# EAGLE design ife19_TS_BMS_LTC6813_Testing (EAGLE 9.2.2)

## Sheet 1 of 3: Power
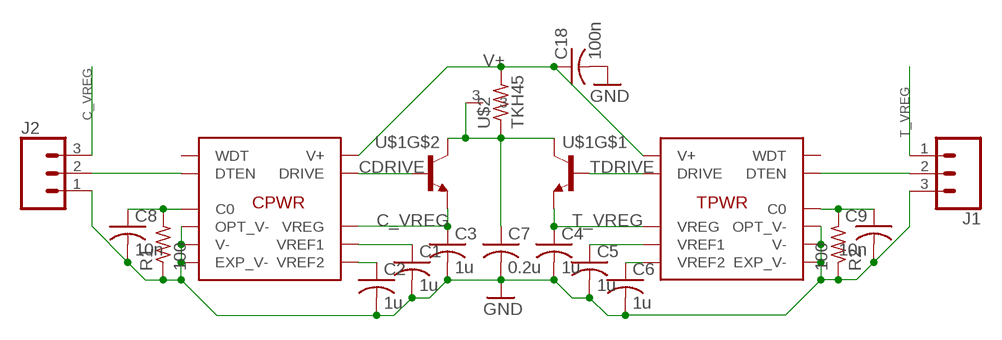
[diagram p0: schematic, sheet 1]

### Parts
C  LTC6813-1  [HTQFP-64-EXP]
C1  1u  C-USC0603  [C0603]
C2  1u  C-USC0603  [C0603]
C3  1u  C-USC0603  [C0603]
C4  1u  C-USC0603  [C0603]
C5  1u  C-USC0603  [C0603]
C6  1u  C-USC0603  [C0603]
C7  0.2u  C-USC1206  [C1206]
C8  10n  C-USC0603  [C0603]
C9  10n  C-USC0603  [C0603]
C18  100n  C-USC0603  [C0603]
J1  CONN_03  [1X03]
J2  CONN_03  [1X03]
R1  100  R-US_R0603  [R0603]
R2  100  R-US_R0603  [R0603]
T  LTC6813-1  [HTQFP-64-EXP]
U$1  PHPT610030NK  [LFPAK56D]
U$2  TKH45  [TO252-TKH-45]

### Nets
C_VREG: C3.1 C.48(PWR:VREG) J2.3 U$1.E2(E) ; also sheet 3
CDRIVE: C.49(PWR:DRIVE) U$1.B2(B)
GND: C1.2 C2.2 C3.2 C4.2 C5.2 C6.2 C7.2 C8.2 C9.2 C18.2 C.59(PWR:V-) C.60(PWR:OPT_V-) C.65(PWR:EXP_V-) J1.3 J2.1 R1.1 R2.1 T.59(PWR:V-) T.60(PWR:OPT_V-) T.65(PWR:EXP_V-) ; also sheet 2,3
N$4: C1.1 C.51(PWR:VREF1)
N$5: C2.1 C.50(PWR:VREF2)
N$7: C5.1 T.51(PWR:VREF1)
N$8: C6.1 T.50(PWR:VREF2)
N$9: C8.1 C.38(PWR:C0) R1.2
N$12: C7.1 U$1.C1(C) U$1.C2(C) U$2.1 U$2.3
N$15: C9.1 R2.2 T.38(PWR:C0)
N$41: J1.2 T.52(PWR:DTEN)
N$62: C.52(PWR:DTEN) J2.2
T_VREG: C4.1 J1.1 T.48(PWR:VREG) U$1.E1(E) ; also sheet 3
TDRIVE: T.49(PWR:DRIVE) U$1.B1(B)
V+: C18.1 C.1(PWR:V+) T.1(PWR:V+) U$2.2
Unconnected: C.56(PWR:WDT) T.56(PWR:WDT)

## Sheet 2 of 3: Cells
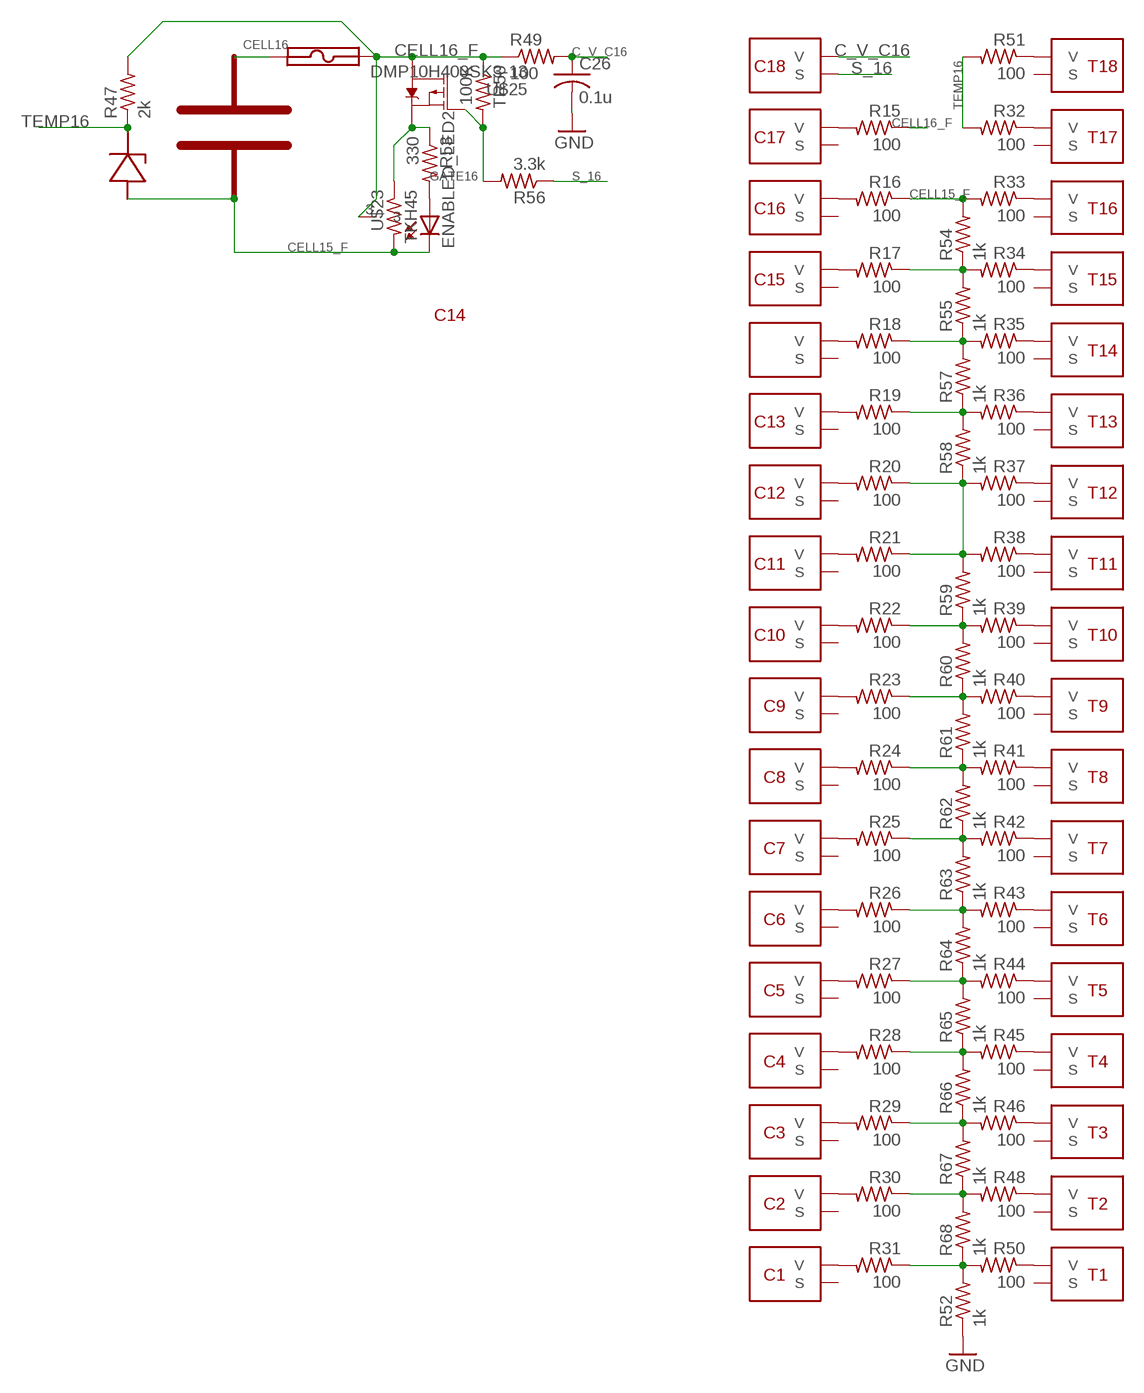
[diagram p1: schematic, sheet 2]

### Parts
C26  0.1u  C-USC0603K  [C0603K]
ENABLED_LED2  LEDCHIPLED_0603  [CHIPLED_0603]
R15  100  R-US_R0603  [R0603]
R16  100  R-US_R0603  [R0603]
R17  100  R-US_R0603  [R0603]
R18  100  R-US_R0603  [R0603]
R19  100  R-US_R0603  [R0603]
R20  100  R-US_R0603  [R0603]
R21  100  R-US_R0603  [R0603]
R22  100  R-US_R0603  [R0603]
R23  100  R-US_R0603  [R0603]
R24  100  R-US_R0603  [R0603]
R25  100  R-US_R0603  [R0603]
R26  100  R-US_R0603  [R0603]
R27  100  R-US_R0603  [R0603]
R28  100  R-US_R0603  [R0603]
R29  100  R-US_R0603  [R0603]
R30  100  R-US_R0603  [R0603]
R31  100  R-US_R0603  [R0603]
R32  100  R-US_R0603  [R0603]
R33  100  R-US_R0603  [R0603]
R34  100  R-US_R0603  [R0603]
R35  100  R-US_R0603  [R0603]
R36  100  R-US_R0603  [R0603]
R37  100  R-US_R0603  [R0603]
R38  100  R-US_R0603  [R0603]
R39  100  R-US_R0603  [R0603]
R40  100  R-US_R0603  [R0603]
R41  100  R-US_R0603  [R0603]
R42  100  R-US_R0603  [R0603]
R43  100  R-US_R0603  [R0603]
R44  100  R-US_R0603  [R0603]
R45  100  R-US_R0603  [R0603]
R46  100  R-US_R0603  [R0603]
R47  2k  R-US_R0603  [R0603]
R48  100  R-US_R0603  [R0603]
R49  100  R-US_R0603  [R0603]
R50  100  R-US_R0603  [R0603]
R51  100  R-US_R0603  [R0603]
R52  1k  R-US_R0603  [R0603]
R53  330  R-US_R0603  [R0603]
R54  1k  R-US_R0603  [R0603]
R55  1k  R-US_R0603  [R0603]
R56  3.3k  R-US_R0603  [R0603]
R57  1k  R-US_R0603  [R0603]
R58  1k  R-US_R0603  [R0603]
R59  1k  R-US_R0603  [R0603]
R60  1k  R-US_R0603  [R0603]
R61  1k  R-US_R0603  [R0603]
R62  1k  R-US_R0603  [R0603]
R63  1k  R-US_R0603  [R0603]
R64  1k  R-US_R0603  [R0603]
R65  1k  R-US_R0603  [R0603]
R66  1k  R-US_R0603  [R0603]
R67  1k  R-US_R0603  [R0603]
R68  1k  R-US_R0603  [R0603]
TR50  100K  R-US_R0603  [R0603]
U$6  LI6PT  [6PT]
U$22  04661206  [R1206W]
U$23  TKH45  [TO252-TKH-45]
U$25  DMP10H400SK3-13  [TO252]

### Nets
C_V_C16: C26.1 C.2(18:V) R49.2
CELL15_F: ENABLED_LED2.C R16.1 R33.2 R54.2 U$6.1(TEMP-) U$6.CELLH-(CELL-) U$6.CELLP-(CELL-) U$23.2
CELL16: U$6.CELLH+(CELL+) U$6.CELLP+(CELL+) U$22.1
CELL16_F: R15.1 R47.2 R49.1 TR50.1 U$22.2 U$23.3 U$25.2(D)
GATE16: R56.2 TR50.2 U$25.1(G)
GND: C26.2 R52.1 ; also sheet 1,3
N$3: ENABLED_LED2.A R53.2
N$6: C.4(17:V) R15.2
N$14: C.6(16:V) R16.2
N$17: C.8(15:V) R17.2
N$27: C.10(14:V) R18.2
N$28: C.12(13:V) R19.2
N$30: C.14(12:V) R20.2
N$31: C.16(11:V) R21.2
N$32: C.18(10:V) R22.2
N$33: C.20(9:V) R23.2
N$34: C.22(8:V) R24.2
N$35: C.24(7:V) R25.2
N$36: C.26(6:V) R26.2
N$37: C.28(5:V) R27.2
N$38: C.30(4:V) R28.2
N$39: C.32(3:V) R29.2
N$40: C.34(2:V) R30.2
N$42: C.36(1:V) R31.2
N$43: R32.1 T.4(17:V)
N$44: R33.1 T.6(16:V)
N$45: R34.1 T.8(15:V)
N$46: R35.1 T.10(14:V)
N$47: R36.1 T.12(13:V)
N$48: R37.1 T.14(12:V)
N$49: R38.1 T.16(11:V)
N$50: R39.1 T.18(10:V)
N$51: R40.1 T.20(9:V)
N$52: R41.1 T.22(8:V)
N$53: R42.1 T.24(7:V)
N$54: R43.1 T.26(6:V)
N$55: R44.1 T.28(5:V)
N$56: R45.1 T.30(4:V)
N$57: R46.1 T.32(3:V)
N$58: R48.1 T.34(2:V)
N$59: R50.1 T.36(1:V)
N$60: R51.1 T.2(18:V)
N$63: R20.1 R21.1 R37.2 R38.2 R58.1 R59.2
N$64: R17.1 R34.2 R54.1 R55.2
N$65: R18.1 R35.2 R55.1 R57.2
N$66: R19.1 R36.2 R57.1 R58.2
N$67: R22.1 R39.2 R59.1 R60.2
N$68: R23.1 R40.2 R60.1 R61.2
N$69: R24.1 R41.2 R61.1 R62.2
N$70: R25.1 R42.2 R62.1 R63.2
N$71: R26.1 R43.2 R63.1 R64.2
N$72: R27.1 R44.2 R64.1 R65.2
N$73: R28.1 R45.2 R65.1 R66.2
N$74: R29.1 R46.2 R66.1 R67.2
N$75: R30.1 R48.2 R67.1 R68.2
N$76: R31.1 R50.2 R52.2 R68.1
N$77: R53.1 U$23.1 U$25.3(S)
S_16: C.3(18:S) R56.1
TEMP16: R32.2 R47.1 R51.2 U$6.2(TEMP+)
Unconnected: C.5(17:S) C.7(16:S) C.9(15:S) C.11(14:S) C.13(13:S) C.15(12:S) C.17(11:S) C.19(10:S) C.21(9:S) C.23(8:S) C.25(7:S) C.27(6:S) C.29(5:S) C.31(4:S) C.33(3:S) C.35(2:S) C.37(1:S) T.3(18:S) T.5(17:S) T.7(16:S) T.9(15:S) T.11(14:S) T.13(13:S) T.15(12:S) T.17(11:S) T.19(10:S) T.21(9:S) T.23(8:S) T.25(7:S) T.27(6:S) T.29(5:S) T.31(4:S) T.33(3:S) T.35(2:S) T.37(1:S)

## Sheet 3 of 3: Comms
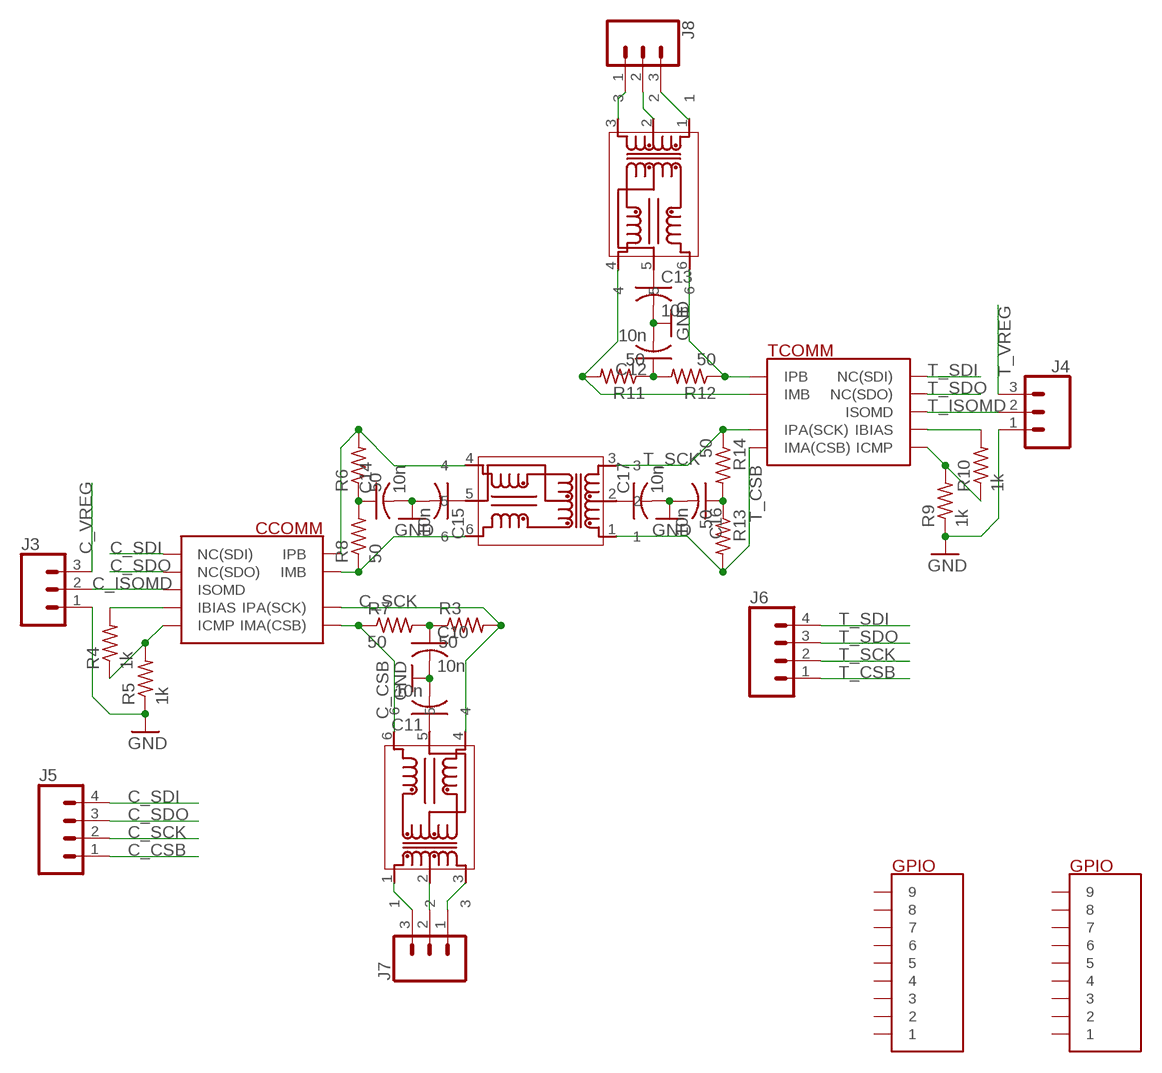
[diagram p2: schematic, sheet 3]

### Parts
C10  10n  C-USC0603K  [C0603K]
C11  10n  C-USC0603K  [C0603K]
C12  10n  C-USC0603K  [C0603K]
C13  10n  C-USC0603K  [C0603K]
C14  10n  C-USC0603K  [C0603K]
C15  10n  C-USC0603K  [C0603K]
C16  10n  C-USC0603K  [C0603K]
C17  10n  C-USC0603K  [C0603K]
J3  CONN_03  [1X03]
J4  CONN_03  [1X03]
J5  CONN_04  [1X04]
J6  CONN_04  [1X04]
J7  CONN_03  [1X03]
J8  CONN_03  [1X03]
R3  50  R-US_R0603  [R0603]
R4  1k  R-US_R0603  [R0603]
R5  1k  R-US_R0603  [R0603]
R6  50  R-US_R0603  [R0603]
R7  50  R-US_R0603  [R0603]
R8  50  R-US_R0603  [R0603]
R9  1k  R-US_R0603  [R0603]
R10  1k  R-US_R0603  [R0603]
R11  50  R-US_R0603  [R0603]
R12  50  R-US_R0603  [R0603]
R13  50  R-US_R0603  [R0603]
R14  50  R-US_R0603  [R0603]
U$3  HM2108NL  [HM2108NL]
U$4  HM2108NL  [HM2108NL]
U$5  HM2108NL  [HM2108NL]

### Nets
C_CSB: C.61(COMM:IMA(CSB)) J5.1 R7.1 U$3.6
C_ISOMD: C.55(COMM:ISOMD) J3.2
C_SCK: C.62(COMM:IPA(SCK)) J5.2 R3.2 U$3.4
C_SDI: C.53(COMM:NC(SDI)) J5.4
C_SDO: C.54(COMM:NC(SDO)) J5.3
C_VREG: J3.3 ; also sheet 1
GND: C10.2 C11.2 C12.2 C13.2 C14.2 C15.2 C16.2 C17.2 J3.1 J4.1 R5.1 R9.1 ; also sheet 1,2
N$1: C.58(COMM:ICMP) R4.1 R5.2
N$2: C.57(COMM:IBIAS) R4.2
N$10: R10.2 T.57(COMM:IBIAS)
N$11: R9.2 R10.1 T.58(COMM:ICMP)
N$13: C10.1 R3.1 R7.2
N$16: C11.1 U$3.5
N$18: C12.1 R11.1 R12.2
N$19: C13.1 U$4.5
N$20: R11.2 T.63(COMM:IMB) U$4.4
N$21: R12.1 T.64(COMM:IPB) U$4.6
N$22: C14.1 R6.1 R8.2
N$23: C15.1 U$5.5
N$24: C.64(COMM:IPB) R6.2 U$5.4
N$25: C.63(COMM:IMB) R8.1 U$5.6
N$26: C16.1 R13.1 R14.2
N$29: C17.1 U$5.2
N$61: J8.1 U$4.3
N$78: J8.2 U$4.2
N$79: J8.3 U$4.1
N$80: J7.2 U$3.2
N$81: J7.3 U$3.1
N$82: J7.1 U$3.3
T_CSB: J6.1 R13.2 T.61(COMM:IMA(CSB)) U$5.1
T_ISOMD: J4.2 T.55(COMM:ISOMD)
T_SCK: J6.2 R14.1 T.62(COMM:IPA(SCK)) U$5.3
T_SDI: J6.4 T.53(COMM:NC(SDI))
T_SDO: J6.3 T.54(COMM:NC(SDO))
T_VREG: J4.3 ; also sheet 1
Unconnected: C.39 C.40 C.41 C.42 C.43 C.44 C.45 C.46 C.47 T.39 T.40 T.41 T.42 T.43 T.44 T.45 T.46 T.47

## Library data of the parts
C T = LTC6813:LTC6813-1
C1-C18 C26 = rcl:C-US: CAPACITOR, American symbol; SPICEPREFIX: C
ENABLED_LED2 = led:LED: LED OSRAM: - CHIPLED LG R971, LG N971, LY N971, LG Q971, LY Q971, LO R971, LY R971 LH N974, LH R974 LS Q976, LO Q976, LY Q976 LO Q996 - Hyper CHIPLED LW Q18S LB Q993, LB Q99A, LB R99A - SideLED LS A670, LO A670, LY A670, LG A670, LP A670 LB A673, LV A673, LT A673, LW A673 LH A674 LY A675 LS A676, LA A676, LO A676, LY A676, LW A676 LS A679, LY A679, LG A679 - Hyper Micro SIDELED® LS Y876, LA Y876, LO Y876, LY Y876 LT Y87S - SmartLED LW L88C, LW L88S LB L89C, LB L89S, LG L890 LS L89K, LO L89K, LY L89K LS L896, LA L896, LO L896, LY L896 - TOPLED LS T670, LO T670, LY T670, LG T670, LP T670 LSG T670, LSP T670, LSY T670, LOP T670, LYG T670 LG T671, LOG T671, LSG T671 LB T673, LV T673, LT T673, LW T673 LH T674 LS T676, LA T676, LO T676, LY T676, LB T676, LH T676, LSB T676, LW T676 LB T67C, LV T67C, LT T67C, LS T67K, LO T67K, LY T67K, LW E67C LS E67B, LA E67B, LO E67B, LY E67B, LB E67C, LV E67C, LT E67C LW T67C LS T679, LY T679, LG T679 LS T770, LO T770, LY T770, LG T770, LP T770 LB T773, LV T773, LT T773, LW T773 LH T774 LS E675, LA E675, LY E675, LS T675 LS T776, LA T776, LO T776, LY T776, LB T776 LHGB T686 LT T68C, LB T68C - Hyper Mini TOPLED® LB M676 - Mini TOPLED Santana® LG M470 LS M47K, LO M47K, LY M47K Source: http://www.osram.convergy.de LUXEON: - LUMILED® LXK2-PW12-R00, LXK2-PW12-S00, LXK2-PW14-U00, LXK2-PW14-V00 LXK2-PM12-R00, LXK2-PM12-S00, LXK2-PM14-U00 LXK2-PE12-Q00, LXK2-PE12-R00, LXK2-PE12-S00, LXK2-PE14-T00, LXK2-PE14-U00 LXK2-PB12-K00, LXK2-PB12-L00, LXK2-PB12-M00, LXK2-PB14-N00, LXK2-PB14-P00, LXK2-PB14-Q00 LXK2-PR12-L00, LXK2-PR12-M00, LXK2-PR14-Q00, LXK2-PR14-R00 LXK2-PD12-Q00, LXK2-PD12-R00, LXK2-PD12-S00 LXK2-PH12-R00, LXK2-PH12-S00 LXK2-PL12-P00, LXK2-PL12-Q00, LXK2-PL12-R00 Source: www.luxeon.com KINGBRIGHT: KA-3528ASYC Source: www.kingbright.com
J1-J4 J7 J8 = SparkFun-Connectors:CONN_03: Multi connection point. Often used as Generic Header-pin footprint for 0.1 inch spaced/style header connections On any of the 0.1 inch spaced packages, you can populate with these: Break Away Headers - Straight <https://www.sparkfun.com/products/116> (PRT-00116) Break Away Male Headers - Right Angle <https://www.sparkfun.com/products/553> (PRT-00553) Female Headers <https://www.sparkfun.com/products/115> (PRT-00115) Break Away Headers - Machine Pin <https://www.sparkfun.com/products/117> (PRT-00117) Break Away Female Headers - Swiss Machine Pin <https://www.sparkfun.com/products/743> (PRT-00743) Stackable Header - 3 Pin (Female, 0.1") <https://www.sparkfun.com/products/13875> (PRT-13875) For SCREWTERMINALS and SPRING TERMINALS visit here: Screw Terimnals on SparkFun.com <https://www.sparkfun.com/search/results?term=Screw+Terminals> (5mm/3.5mm/2.54mm spacing) This device is also useful as a general connection point to wire up your design to another part of your project. Our various solder wires solder well into these plated through hole pads. Hook-Up Wire - Assortment (Stranded, 22 AWG) <https://www.sparkfun.com/products/11375> (PRT-11375) Hook-Up Wire - Assortment (Solid Core, 22 AWG) <https://www.sparkfun.com/products/11367> (PRT-11367) View the entire wire category on our website here <https://www.sparkfun.com/categories/141> Special notes: Molex polarized connector foot print use with SKU : PRT-08232 with associated crimp pins and housings.
J5 J6 = SparkFun-Connectors:CONN_04: Multi connection point. Often used as Generic Header-pin footprint for 0.1 inch spaced/style header connections On any of the 0.1 inch spaced packages, you can populate with these: Break Away Headers - Straight <https://www.sparkfun.com/products/116> (PRT-00116) Break Away Male Headers - Right Angle <https://www.sparkfun.com/products/553> (PRT-00553) Female Headers <https://www.sparkfun.com/products/115> (PRT-00115) Break Away Headers - Machine Pin <https://www.sparkfun.com/products/117> (PRT-00117) Break Away Female Headers - Swiss Machine Pin <https://www.sparkfun.com/products/743> (PRT-00743) For SCREWTERMINALS and SPRING TERMINALS visit here: Screw Terimnals on SparkFun.com <https://www.sparkfun.com/search/results?term=Screw+Terminals> (5mm/3.5mm/2.54mm spacing) This device is also useful as a general connection point to wire up your design to another part of your project. Our various solder wires solder well into these plated through hole pads. Hook-Up Wire - Assortment (Stranded, 22 AWG) <https://www.sparkfun.com/products/11375> (PRT-11375) Hook-Up Wire - Assortment (Solid Core, 22 AWG) <https://www.sparkfun.com/products/11367> (PRT-11367) View the entire wire category on our website here <https://www.sparkfun.com/categories/141> Special notes: Molex polarized connector foot print use with SKU : PRT-08231 with associated crimp pins and housings. 1MM SMD Version SKU: PRT-10208; PROD_ID: CONN-09696
R1-R68 TR50 = rcl:R-US_: RESISTOR, American symbol; SPICEPREFIX: R
U$1 = IFE_Transistors:PHPT610030NK
U$2 U$23 = IFE_Resistors:TKH45
U$3-U$5 = Transformers and Chokes:HM2108NL
U$6 = IFE_Energus:LI6PT
U$22 = IFE_Fuses:0466
U$25 = IFE_Transistors:DMP10H400SK3-13

## Board
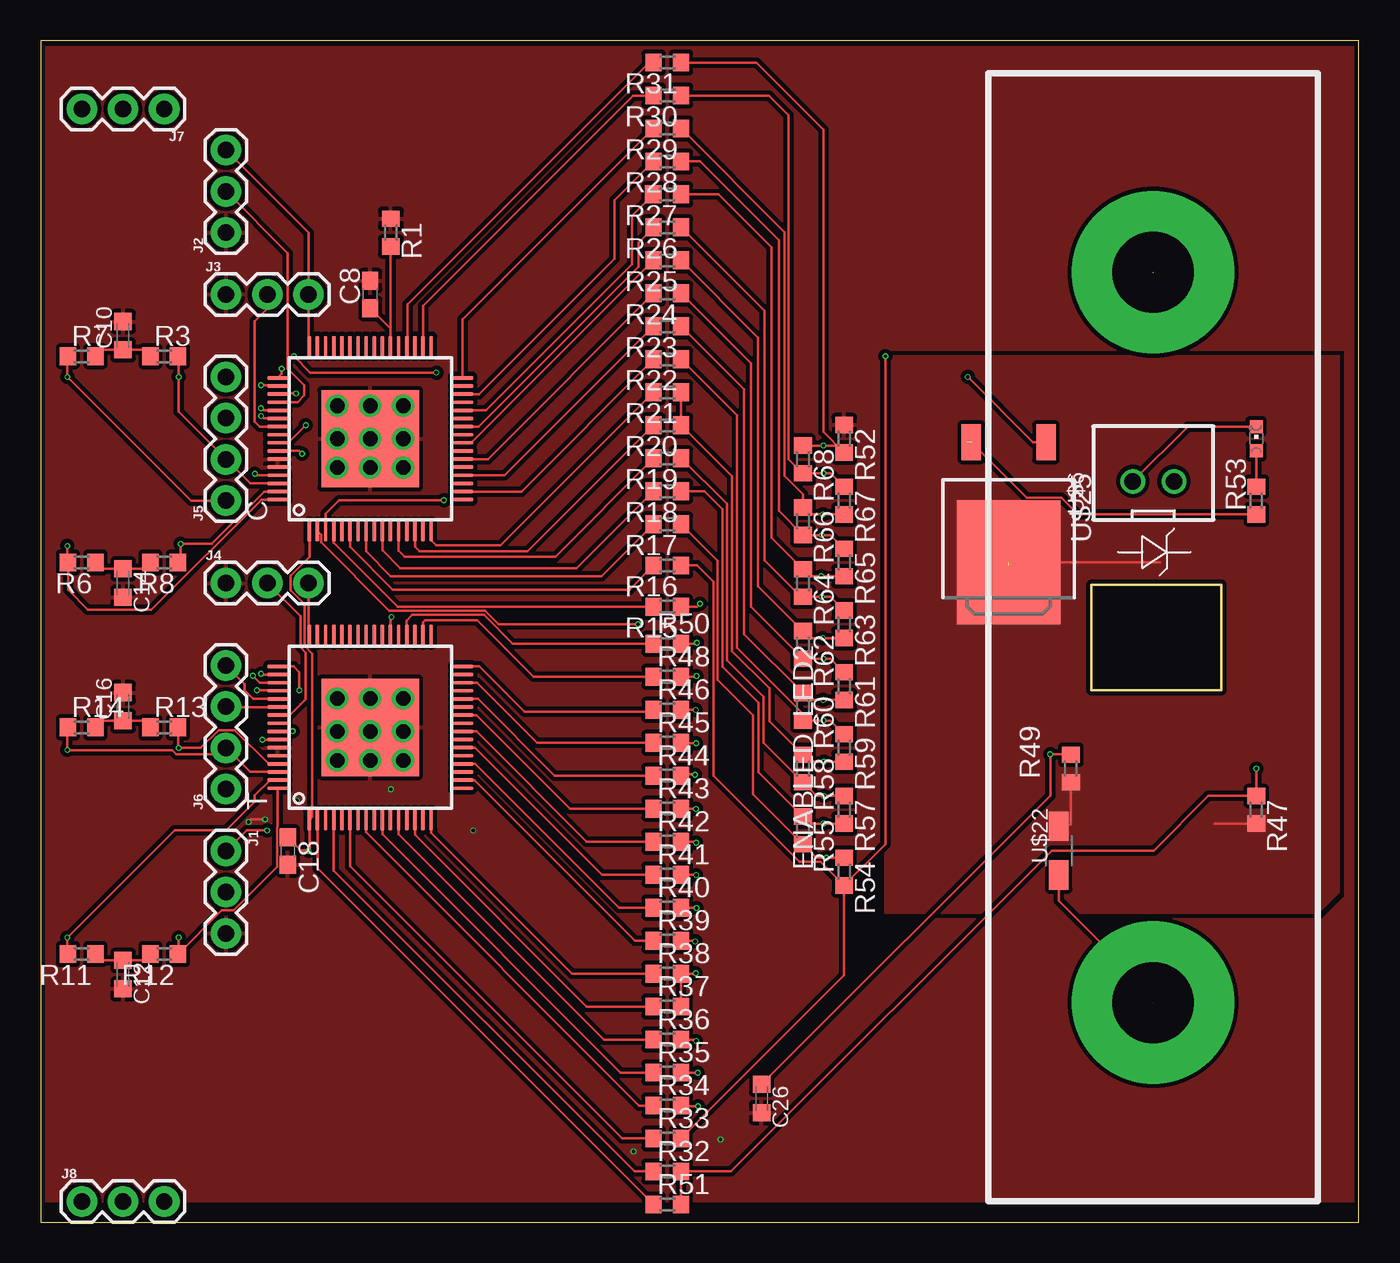
[diagram p3: board, top side]
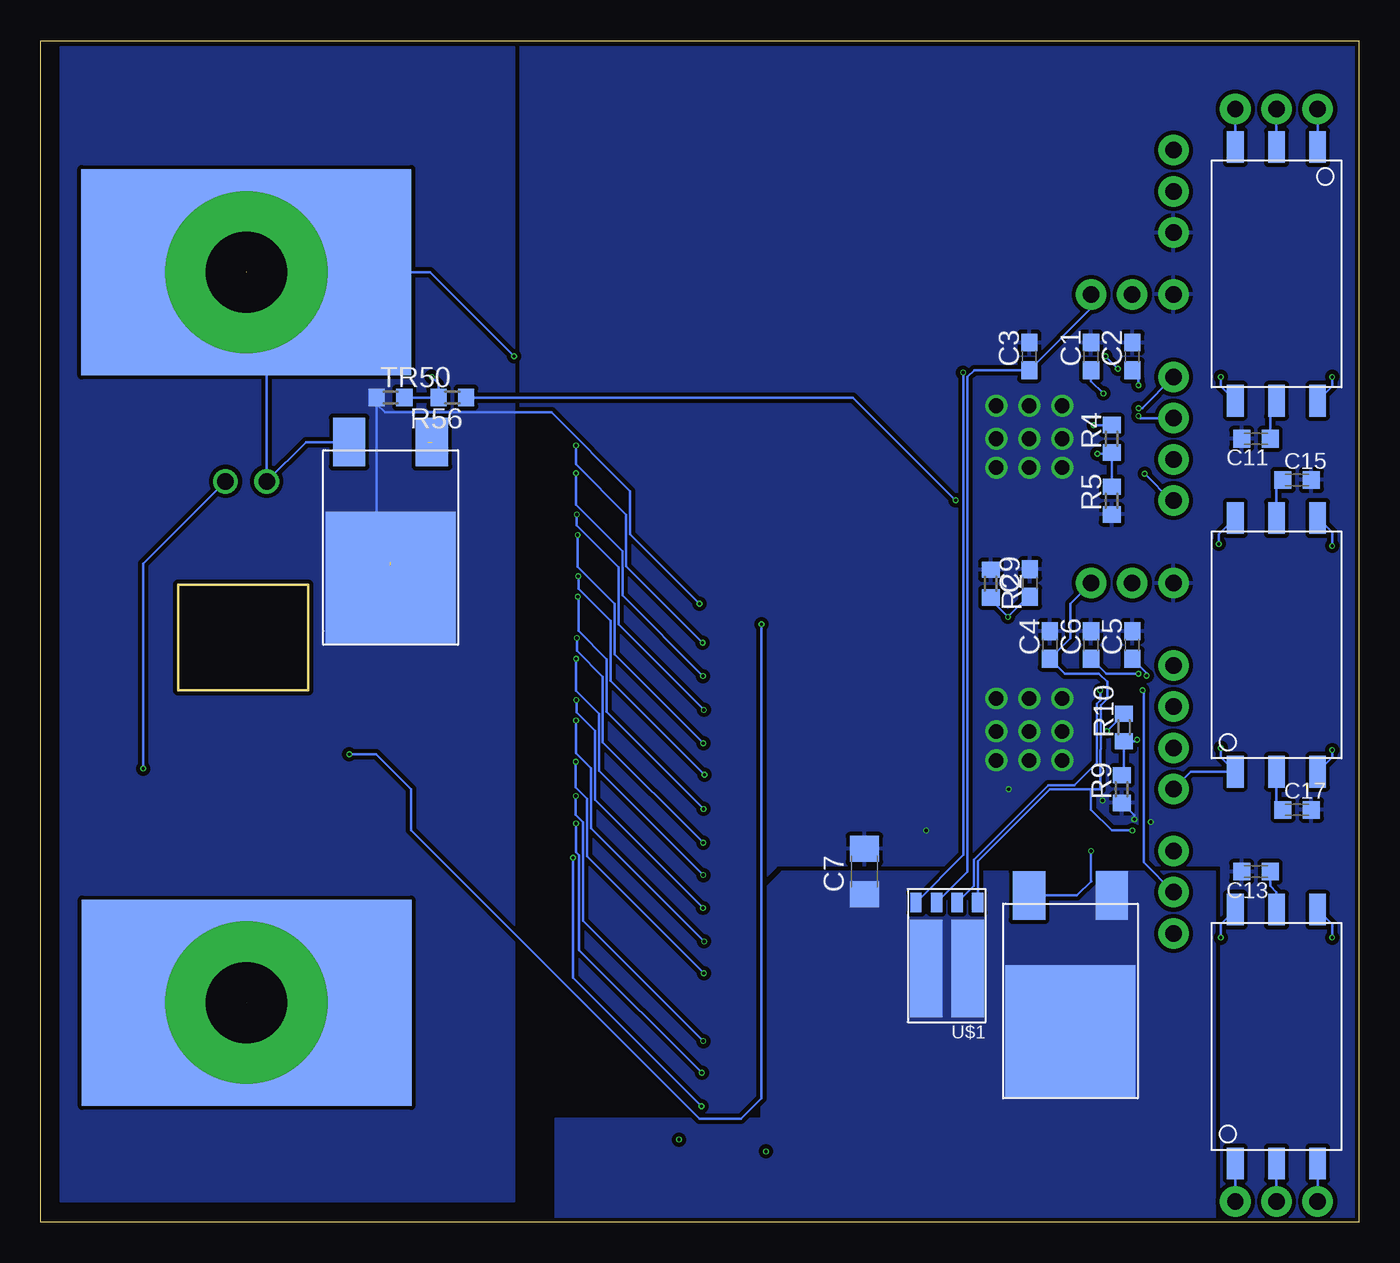
[diagram p4: board, bottom side, seen from below]

Size 81.26 x 72.79 mm. Coordinates in mm from the lower left corner, seen from the top.
Outline: 0,0 81.26,0 81.26,72.79 0,72.79 0,0
Copper layers (1*16): Top 0.035mm / dielectric 0.5mm / Bottom 0.035mm
Design rules "JLC_4layer *": minimum track width 3.5mil, minimum drill 0.2mm, track to track 3.5mil, track to pad 3.5mil, pad to pad 3.5mil, via to via 5mil, smd to smd 3.5mil, copper to edge 8mil, drill to drill 6mil, minimum pad ring 3mil, minimum via ring 3mil, stop-mask expansion 4mil, vias tented up to drill 0mil, thermal gap 10mil

### Footprints (pad centres in the part's own frame; a part is rotated, then mirrored left to right if it is on the bottom)
HTQFP-64-EXP = smd 1.3 x 0.25: 1 -5.7,3.75; 2 -5.7,3.25; 3 -5.7,2.75; 4 -5.7,2.25; 5 -5.7,1.75; 6 -5.7,1.25; 7 -5.7,0.75; 8 -5.7,0.25; 9 -5.7,-0.25; 10 -5.7,-0.75; 11 -5.7,-1.25; 12 -5.7,-1.75; 13 -5.7,-2.25; 14 -5.7,-2.75; 15 -5.7,-3.25; 16 -5.7,-3.75; 33 5.7,-3.75; 34 5.7,-3.25; 35 5.7,-2.75; 36 5.7,-2.25; 37 5.7,-1.75; 38 5.7,-1.25; 39 5.7,-0.75; 40 5.7,-0.25; 41 5.7,0.25; 42 5.7,0.75; 43 5.7,1.25; 44 5.7,1.75; 45 5.7,2.25; 46 5.7,2.75; 47 5.7,3.25; 48 5.7,3.75 | smd 0.25 x 1.3: 17 -3.75,-5.7; 18 -3.25,-5.7; 19 -2.75,-5.7; 20 -2.25,-5.7; 21 -1.75,-5.7; 22 -1.25,-5.7; 23 -0.75,-5.7; 24 -0.25,-5.7; 25 0.25,-5.7; 26 0.75,-5.7; 27 1.25,-5.7; 28 1.75,-5.7; 29 2.25,-5.7; 30 2.75,-5.7; 31 3.25,-5.7; 32 3.75,-5.7; 49 3.75,5.7; 50 3.25,5.7; 51 2.75,5.7; 52 2.25,5.7; 53 1.75,5.7; 54 1.25,5.7; 55 0.75,5.7; 56 0.25,5.7; 57 -0.25,5.7; 58 -0.75,5.7; 59 -1.25,5.7; 60 -1.75,5.7; 61 -2.25,5.7; 62 -2.75,5.7; 63 -3.25,5.7; 64 -3.75,5.7 | smd 6 x 6: 65 0,0
C0603 = smd 1.1 x 1: 1 -0.85,0; 2 0.85,0
C1206 = smd 1.6 x 1.8: 1 -1.4,0; 2 1.4,0
C0603K = smd 1.05 x 1.08: 1 -0.875,0; 2 0.875,0
CHIPLED_0603 = smd 0.8 x 0.8: A 0,-0.75; C 0,0.75
1X03 = drill 1.016 pad 1.88: 1 0,0; 2 2.54,0; 3 5.08,0
1X04 = drill 1.016 pad 1.88: 1 0,0; 2 2.54,0; 3 5.08,0; 4 7.62,0
R0603 = smd 1 x 1.1: 1 -0.85,0; 2 0.85,0
LFPAK56D = smd 0.7 x 1.2: B1 -0.635,-3.175; B2 1.905,-3.175; E1 -1.905,-3.175; E2 0.635,-3.175 | smd 2 x 6: C1 -1.27,0.9; C2 1.27,0.9
TO252-TKH-45 = smd 2 x 3: 1 -2.55,-12.5; 2 2.55,-12.5 | smd 8 x 8.2: 3 0,-4.1
HM2108NL = smd 1.02 x 1.95: 1 -2.54,-7.82; 2 0,-7.82; 3 2.54,-7.82; 4 2.54,7.82; 5 0,7.82; 6 -2.54,7.82
6PT = drill 1.016: 1 8.9,44.36; 2 11.44,44.36 | drill 5 pad 10: CELLH+ 10.15,12.25; CELLH- 10.15,57.25 | smd 20.32 x 12.7 bottom: CELLP+ 10.135,12.243; CELLP- 10.16,57.252
R1206W = smd 1.8 x 1.2: 1 -1.499,0; 2 1.499,0
TO252 = smd 1.2 x 2.2: 1 -2.279,-7.409; 3 2.321,-7.409 | smd 6.35 x 7.62: 2 0.021,-0.009

### Placement (x,y rotation side)
C  20.32,48.26 90 top
C1  16.51,53.34 90 bottom
C2  13.97,53.34 90 bottom
C3  20.32,53.34 90 bottom
C4  19.05,35.56 90 bottom
C5  13.97,35.56 90 bottom
C6  16.51,35.56 90 bottom
C7  30.48,21.59 90 bottom
C8  20.32,57.15 90 top
C9  20.27,39.37 90 bottom
C10  5.08,54.61 90 top
C11  6.35,48.26 180 bottom
C12  5.08,15.24 270 top
C13  6.35,21.59 180 bottom
C14  5.08,39.37 270 top
C15  3.81,45.72 0 bottom
C16  5.08,31.75 90 top
C17  3.81,25.4 0 bottom
C18  15.24,22.86 270 top
C26  44.45,7.62 270 top
ENABLED_LED2  74.93,48.26 0 top
J1  11.43,22.86 270 top
J2  11.43,60.96 90 top
J3  11.43,57.15 0 top
J4  11.43,39.37 0 top
J5  11.43,44.45 90 top
J6  11.43,26.67 90 top
J7  7.62,68.58 180 top
J8  2.54,1.27 0 top
R1  21.59,60.96 270 top
R2  22.69,39.33 270 bottom
R3  7.62,53.34 0 top
R4  15.24,48.26 90 bottom
R5  15.24,44.45 90 bottom
R6  2.54,40.64 180 top
R7  2.54,53.34 0 top
R8  7.62,40.64 180 top
R9  14.62,26.67 90 bottom
R10  14.48,30.47 90 bottom
R11  2.54,16.51 180 top
R12  7.62,16.51 180 top
R13  7.62,30.48 0 top
R14  2.54,30.48 0 top
R15  38.63,37.91 180 top
R16  38.63,40.45 180 top
R17  38.63,42.99 180 top
R18  38.63,45.03 180 top
R19  38.63,47.06 180 top
R20  38.63,49.09 180 top
R21  38.63,51.12 180 top
R22  38.63,53.15 180 top
R23  38.63,55.19 180 top
R24  38.63,57.22 180 top
R25  38.63,59.25 180 top
R26  38.63,61.28 180 top
R27  38.62,63.32 180 top
R28  38.63,65.35 180 top
R29  38.63,67.38 180 top
R30  38.63,69.41 180 top
R31  38.63,71.44 180 top
R32  38.63,3.12 0 top
R33  38.63,5.15 0 top
R34  38.63,7.18 0 top
R35  38.63,9.21 0 top
R36  38.63,11.24 0 top
R37  38.63,13.28 0 top
R38  38.63,15.31 0 top
R39  38.63,17.34 0 top
R40  38.63,19.37 0 top
R41  38.63,21.4 0 top
R42  38.63,23.44 0 top
R43  38.63,25.47 0 top
R44  38.63,27.5 0 top
R45  38.63,29.53 0 top
R46  38.63,31.56 0 top
R47  74.93,25.4 270 top
R48  38.63,33.6 0 top
R49  63.5,27.94 90 top
R50  38.63,35.63 0 top
R51  38.63,1.08 0 top
R52  49.53,48.26 270 top
R53  74.93,44.45 90 top
R54  49.53,21.59 270 top
R55  46.99,24.13 270 top
R56  55.88,50.8 180 bottom
R57  49.53,25.4 270 top
R58  46.99,27.94 270 top
R59  49.53,29.21 270 top
R60  46.99,31.75 270 top
R61  49.53,33.02 270 top
R62  46.99,35.56 270 top
R63  49.53,36.83 270 top
R64  46.99,39.37 270 top
R65  49.53,40.64 270 top
R66  46.99,43.18 270 top
R67  49.53,44.45 270 top
R68  46.99,46.99 270 top
T  20.32,30.48 90 top
TR50  59.69,50.8 0 bottom
U$1  25.4,16.51 180 bottom
U$2  17.78,7.62 180 bottom
U$3  5.08,58.42 180 bottom
U$4  5.08,11.43 0 bottom
U$5  5.08,35.56 0 bottom
U$6  58.42,1.27 0 top
U$22  62.76,22.89 90 top
U$23  59.69,35.56 180 bottom
U$25  59.69,40.64 180 top

### Tracks (layer width: path | path; a pad name or v marks a point on that pad's centre or on a via)
C_CSB  (via drill 0.2)
  Top 0.152: R7.1 1.65,53.3 v1.65,52.07 9.27,44.45 J5.1 | v13.21,46.1 13.3,46.01 C.61
  Bottom 0.152: U$3.6 1.65,51.49 v1.65,52.07 | J5.1 11.56,44.45 v13.21,46.1
C_ISOMD
  Top 0.152: J3.2 13.97,56.26 13.21,55.5 13.21,49.31 13.51,49.01 C.55
C_SCK  (via drill 0.2)
  Top 0.152: R3.2 8.51,53.3 v8.51,52.07 8.51,49.91 J5.2 12.91,45.51 C.62
  Bottom 0.152: U$3.4 8.51,51.49 v8.51,52.07
C_SDI  (via drill 0.2)
  Top 0.152: v13.59,50.14 13.69,50.04 13.75,50.04 13.77,50.01 C.53
  Bottom 0.152: J5.4 13.36,50.14 v13.59,50.14
C_SDO  (via drill 0.2)
  Top 0.152: v13.59,49.66 13.74,49.51 C.54
  Bottom 0.152: J5.3 13.46,49.53 v13.59,49.66
C_V_C16  (via drill 0.2)
  Top 0.152: C26.1 62.23,26.27 v62.23,28.82 63.48,28.82 R49.2 | C.2 17.28,42.35 17.28,41.87 21.48,37.67 27.4,37.67 28.24,36.83 v36.83,36.83
  Bottom 0.152: v36.83,36.83 36.83,7.62 38.1,6.35 40.64,6.35 58.42,24.13 58.42,26.67 60.56,28.82 v62.23,28.82
C_VREG
  Top 0.152: C.48 16.51,54.02 J3.3 16.51,60.96 J2.3
  Bottom 0.152: J3.3 16.51,56.3 C3.1 23.71,52.49 24.13,52.07 24.13,21.59 U$1.E2
CDRIVE  (via drill 0.2)
  Top 0.152: v24.4,52.34 16.62,52.34 v15.62,53.34 | v14.86,52.58 14.86,52.25 C.49
  Bottom 0.152: U$1.B2 24.37,22.62 24.37,52.31 v24.4,52.34 | v15.62,53.34 v14.86,52.58
CELL15_F  (via drill 0.2)  (1 unrouted)
  Top 0.152: R54.2 48.07,22.2 46.79,22.2 41.48,27.51 41.48,39.44 40.46,40.45 R16.1 | R54.2 49.53,15.2 R33.2 | ENABLED_LED2.C 70.7,49.01 U$6.1 | R54.2 52.07,23.28 v52.07,53.34
  Bottom 0.152: U$23.2 64.89,48.06 U$6.1 67.32,57.26 U$6.CELLP- | v52.07,53.34 57.25,58.52 U$6.CELLH-
CELL16  (1 unrouted)
  Top 0.152: U$22.1 62.76,19.79 68.58,13.97 U$6.CELLH+
CELL16_F  (via drill 0.2)  (1 unrouted)
  Top 0.152: R15.1 40.45,37.91 v40.64,38.1 | R47.2 72.39,24.55 | R49.1 63.5,24.5 U$22.2 | U$25.2 68.99,40.65
  Bottom 0.152: v40.64,38.1 44.92,42.38 44.92,45.04 49.77,49.88 60.02,49.88 60.54,50.4 TR50.1 60.54,41.3 59.69,40.45 U$23.3
  pour Bottom (isolate 0.254, no thermals): 52.07,72.39 80.01,72.39 80.01,1.27 53.34,1.27 52.07,1.27 52.07,71.12
  pour Top (isolate 0.254, no thermals): 52.07,53.34 80.01,53.34 80.01,20.32 78.74,19.05 52.07,19.05
GATE16  (via drill 0.2)
  Top 0.152: v57.15,52.07 61.17,48.05 U$25.1
  Bottom 0.152: TR50.2 R56.2 56.73,51.65 v57.15,52.07
GND  (via drill 0.2, 0.9)
  Top 0.152: v13.85,24.81 12.99,24.81 v12.82,24.64
  Bottom 0.152: R9.1 13.85,25.05 v13.85,24.81
  other vias: 36.55,4.35 41.91,5.08 15.8,25.97 21.59,26.67 26.67,24.13 20.32,48.26 18.29,50.29 20.32,50.29 22.35,50.29 22.35,48.26 18.29,48.26 18.29,46.48 20.32,46.48 22.35,46.48 20.32,30.23 18.29,32.26 20.32,32.26 22.35,32.26 22.35,30.23 18.29,30.23 18.29,28.45 20.32,28.45 22.35,28.45
  pour Bottom (isolate 0.254, rank 6): 0,72.39 81.28,72.39 81.28,0 0,0
  pour Top (isolate 0.254, rank 6): 0,72.39 81.28,72.39 81.28,1.27 0,1.27
N$1  (via drill 0.2)
  Top 0.152: C.58 15.94,47.51 v16.12,47.34
  Bottom 0.152: v16.12,47.34 15.31,47.34 R4.1 R5.2
N$2  (via drill 0.2)
  Top 0.152: C.57 15.27,48.01 v16.35,49.09
  Bottom 0.152: v16.35,49.09 15.26,49.09 R4.2
N$3
  Top 0.152: R53.2 ENABLED_LED2.A
N$4  (via drill 0.2)
  Top 0.152: v15.75,51.05 14.66,51.05 C.51
  Bottom 0.152: C1.1 16.51,51.82 v15.75,51.05
N$5  (via drill 0.2)
  Top 0.152: v13.59,51.56 14.57,51.56 C.50
  Bottom 0.152: C2.1 13.59,52.11 v13.59,51.56
N$6
  Top 0.152: R15.2 22.01,37.91 18.07,41.86 C.4
N$7  (via drill 0.2)
  Top 0.152: v13.08,33.66 13.51,33.23 T.51
  Bottom 0.152: C5.1 13.08,33.82 v13.08,33.66
N$8  (via drill 0.2)
  Top 0.152: v13.59,33.78 13.64,33.73 T.50
  Bottom 0.152: C6.1 15.58,33.78 v13.59,33.78
N$9
  Top 0.152: C8.1 21.57,55.05 C.38 21.57,56.71 R1.2
N$10  (via drill 0.2)
  Top 0.152: v15.54,30.25 15.39,30.25 15.37,30.23 15.36,30.23 T.57
  Bottom 0.152: v15.54,30.25 14.48,31.3 R10.2
N$11  (via drill 0.2)
  Top 0.152: v13.67,29.72 v13.68,29.73 T.58
  Bottom 0.152: v13.67,29.72 13.77,29.62 R10.1 14.48,27.66 R9.2
N$12
  pour Bottom (isolate 0.254, no thermals): 8.89,21.59 35.56,21.59 36.83,20.32 36.83,6.35 49.53,6.35 49.53,0 8.89,0
N$13
  Top 0.152: R7.2 3.79,53.73 C10.1 6.38,53.73 R3.1
N$14
  Top 0.152: C.6 19.07,41.6 21.7,38.97 36.3,38.97 R16.2
N$15  (via drill 0.2)
  Top 0.152: T.38 21.57,37.22 v21.63,37.28
  Bottom 0.152: R2.2 22.69,38.34 v21.63,37.28 20.39,38.52 C9.1
N$16
  Bottom 0.152: C11.1 5.47,50.2 U$3.5
N$17
  Top 0.152: C.8 20.07,41.32 21.59,39.8 34.59,39.8 R17.2
N$18
  Top 0.152: R12.2 6.38,16.11 C12.1 3.79,16.11 R11.1
N$19
  Bottom 0.152: C13.1 5.47,20.71 5.08,20.32 U$4.5
N$20  (via drill 0.2)
  Top 0.152: R11.2 1.65,16.55 v1.65,17.53 8.26,24.13 11.43,24.13 13.21,25.91 13.21,26.3 14.14,27.23 T.63
  Bottom 0.152: U$4.4 1.65,18.36 v1.65,17.53
N$21  (via drill 0.2)
  Top 0.152: v8.51,17.53 8.51,16.55 R12.1 11.18,19.21 11.89,19.21 14.57,21.9 14.57,24.33 14.62,24.37 T.64
  Bottom 0.152: U$4.6 8.51,18.36 v8.51,17.53
N$22
  Top 0.152: R6.1 3.79,40.24 C14.1 6.38,40.24 R8.2
N$23
  Bottom 0.152: C15.1 5.08,45.33 U$5.5
N$24  (via drill 0.2)
  Top 0.152: v1.65,41.66 1.65,40.68 R6.2 1.69,38.95 2.92,37.72 6.83,37.72 13.62,44.51 C.64
  Bottom 0.152: U$5.4 1.65,42.49 v1.65,41.66
N$25  (via drill 0.2)
  Top 0.152: R8.1 8.64,40.81 v8.64,41.78 10.54,41.78 13.77,45.01 C.63
  Bottom 0.152: v8.64,41.78 8.64,42.36 U$5.6
N$26
  Top 0.152: R14.2 3.79,30.88 C16.1 6.38,30.88 R13.1
N$27
  Top 0.152: C.10 21.07,41.39 22.18,40.28 33.04,40.28 R18.2
N$28
  Top 0.152: C.12 22.07,41.36 22.43,41.01 31.73,41.01 R19.2
N$29
  Bottom 0.152: U$5.2 5.08,25.8 C17.1
N$30
  Top 0.152: C.14 23.07,41.61 23.36,41.32 30.01,41.32 R20.2
N$31
  Top 0.152: C.16 24.07,41.99 24.37,41.69 28.35,41.69 R21.2
N$32
  Top 0.152: C.18 29.64,45.01 R22.2
N$33
  Top 0.152: C.20 28.61,46.01 R23.2
N$34
  Top 0.152: C.22 27.57,47.01 R24.2
N$35
  Top 0.152: C.24 26.54,48.01 R25.2
N$36
  Top 0.152: R26.2 36.84,60.35 36.84,58.87 26.99,49.01 C.26
N$37
  Top 0.152: R27.2 36.46,62.01 36.46,59 27.48,50.01 C.28
N$38
  Top 0.152: R28.2 35.38,62.95 35.38,59.35 27.04,51.01 C.30
N$39
  Top 0.152: C.32 26.02,55.62 R29.2
N$40
  Top 0.152: C.34 23.57,56.46 36.52,69.41 R30.2
N$41  (via drill 0.2)
  Top 0.152: v13.34,32.77 14.58,32.77 T.52
  Bottom 0.152: J1.2 13.27,22.16 13.27,32.7 v13.34,32.77
N$42
  Top 0.152: C.36 22.63,54.02 22.63,56.56 37.51,71.44 R31.2
N$43
  Top 0.152: T.4 18.07,21.64 36.6,3.12 R32.1
N$44
  Top 0.152: T.6 19.07,21.91 35.84,5.15 R33.1
N$45
  Top 0.152: T.8 20.07,24.01 20.07,24 36.89,7.18 R34.1
N$46
  Top 0.152: T.10 21.07,23.89 35.75,9.21 R35.1
N$47
  Top 0.152: T.12 22.07,23.9 34.73,11.24 R36.1
N$48
  Top 0.152: T.14 23.07,23.86 33.65,13.28 R37.1
N$49
  Top 0.152: T.16 24.07,23.98 32.75,15.31 R38.1
N$50
  Top 0.152: T.18 26.74,27.23 36.63,17.34 R39.1
N$51
  Top 0.152: T.20 26.78,28.23 35.64,19.37 R40.1
N$52
  Top 0.152: T.22 26.79,29.23 34.62,21.4 R41.1
N$53
  Top 0.152: T.24 26.86,30.23 33.65,23.43 R42.1
N$54
  Top 0.152: T.26 26.87,31.23 32.63,25.47 R43.1
N$55
  Top 0.152: T.28 26.96,32.23 31.7,27.5 R44.1
N$56
  Top 0.152: T.30 26.92,33.23 30.62,29.53 R45.1
N$57
  Top 0.152: T.32 27.04,34.23 29.82,31.45 37.67,31.45 R46.1
N$58
  Top 0.152: T.34 23.57,36.94 23.71,37.08 26.91,37.08 30.39,33.59 R48.1
N$59
  Top 0.152: T.36 22.57,37.06 22.91,37.4 27.33,37.4 29.11,35.63 R50.1
N$60
  Top 0.152: T.2 17.07,21.79 R51.1
N$61
  Bottom 0.152: U$4.3 J8.1
N$62
  Top 0.152: J2.2 15.24,59.69 15.24,52.58 16.26,51.56 16.26,50.93 15.84,50.51 C.52
N$63  (via drill 0.2)
  Top 0.152: R59.2 v48.27,28.36 47.42,28.36 R58.1 44.92,30.86 44.92,32.88 42.63,35.17 42.63,45.94 R20.1 R21.1 | R37.2 R38.2 40.36,15.31 v40.38,15.33
  Bottom 0.152: v40.38,15.33 47.58,22.52 47.58,26.09 48.27,26.79 v48.27,28.36
N$64  (via drill 0.2)
  Top 0.152: R17.1 41.72,40.75 41.72,33.41 43.91,31.23 43.91,26.36 R55.2 47.83,22.44 v48.44,22.44 R54.1 | v40.52,7.13 39.53,7.13 R34.2
  Bottom 0.152: v48.44,22.44 48.44,15.05 v40.52,7.13
N$65  (via drill 0.2)
  Top 0.152: R57.2 v48.26,24.55 47.42,24.55 R55.1 44.25,27.72 44.25,32 42.03,34.22 42.03,43.93 40.93,45.02 R18.1 | R35.2 40.48,9.21 v40.5,9.19
  Bottom 0.152: v48.26,24.55 48.26,22.8 48.06,22.6 48.06,16.75 v40.5,9.19
N$66  (via drill 0.2)
  Top 0.152: R57.1 v48.27,26.25 47.83,26.25 R58.2 44.55,29.53 44.55,32.37 42.3,34.63 42.3,44.24 R19.1 | R36.2 40.32,11.24 v40.41,11.15
  Bottom 0.152: v40.41,11.15 47.82,18.56 47.82,24.64 48.27,25.1 v48.27,26.25
N$67  (via drill 0.2)
  Top 0.152: R59.1 48.69,30.9 v48.26,30.9 R60.2 46.99,31.32 42.92,35.38 42.92,49.71 R22.1 | R39.2 40.3,17.34 v40.36,17.29
  Bottom 0.152: v40.36,17.29 47.34,24.27 47.34,27.96 48.26,28.88 v48.26,30.9
N$68  (via drill 0.2)
  Top 0.152: R61.2 v48.23,32.17 47.42,32.17 R60.1 43.36,36.23 43.36,51.31 R23.1 | R40.2 39.5,19.35 v40.43,19.35
  Bottom 0.152: v40.43,19.35 47.09,26.01 47.09,30.27 48.23,31.41 v48.23,32.17
N$69  (via drill 0.2)
  Top 0.152: R61.1 48.69,34.71 v48.25,34.71 R62.2 43.8,37.9 43.8,52.9 R24.1 | R41.2 40.39,21.4 v40.41,21.38
  Bottom 0.152: v40.41,21.38 46.85,27.82 46.85,31.33 48.25,32.72 v48.25,34.71
N$70  (via drill 0.2)
  Top 0.152: R63.2 v48.21,35.98 47.42,35.98 R62.1 44.23,39.17 44.23,54.5 R25.1 | R42.2 40.35,23.43 v40.41,23.37
  Bottom 0.152: v40.41,23.37 46.61,29.57 46.61,33.61 48.21,35.21 v48.21,35.98
N$71  (via drill 0.2)
  Top 0.152: R63.1 48.69,38.52 v48.15,38.52 R64.2 46.86,38.52 44.62,40.76 44.62,56.14 R26.1 | R43.2 40.38,25.47 v40.4,25.45
  Bottom 0.152: v40.4,25.45 46.37,31.43 46.37,34.68 48.11,36.42 48.11,38.49 v48.14,38.52 v48.15,38.52
N$72  (via drill 0.2)
  Top 0.152: R65.2 v48.11,39.79 47.42,39.79 R64.1 45.04,42.17 45.04,60.05 41.77,63.32 R27.1 | R44.2 39.56,27.58 40.36,27.58 v40.34,27.56 | v40.34,27.56
  Bottom 0.152: v40.34,27.56 46.13,33.35 46.13,37.03 48.11,39.02 v48.11,39.79
N$73  (via drill 0.2)
  Top 0.152: R65.1 48.69,42.33 v48.16,42.33 R66.2 45.51,43.81 45.51,60.48 40.64,65.34 R28.1 | R45.2 39.51,29.5 v40.41,29.5
  Bottom 0.152: v40.41,29.5 45.89,34.98 45.89,38.1 48.16,40.37 v48.16,42.33
N$74  (via drill 0.2)
  Top 0.152: R67.2 v48.21,43.6 47.42,43.6 R66.1 46.99,44.86 45.86,45.99 45.86,61 R29.1 | R46.2 40.37,31.56 v40.38,31.55
  Bottom 0.152: v40.38,31.55 45.65,36.82 45.65,40.36 48.21,42.92 v48.21,43.6
N$75  (via drill 0.2)
  Top 0.152: R67.1 48.69,46.14 v48.26,46.14 R68.2 46.95,46.14 46.1,46.99 46.1,68.2 44.89,69.41 R30.1 | R48.2 40.39,33.59 v40.43,33.64
  Bottom 0.152: v40.43,33.64 45.41,38.61 45.41,41.33 48.26,44.19 v48.26,46.14
N$76  (via drill 0.2)
  Top 0.152: R68.1 v48.26,47.84 49.1,47.84 R52.2 48.26,48.68 48.26,67.31 44.13,71.44 R31.1 | R50.2 40.39,35.63 v40.45,35.69
  Bottom 0.152: v40.45,35.69 45.16,40.4 45.16,43.58 48.26,46.68 v48.26,47.84
N$77  (1 unrouted)
  Top 0.152: U$25.3 60.79,44.62 62.91,44.62 63.94,43.6 R53.1
N$78
  Bottom 0.152: U$4.2 J8.2
N$79
  Bottom 0.152: U$4.1 J8.3
N$80
  Bottom 0.152: U$3.2 J7.2
N$81
  Bottom 0.152: U$3.1 J7.3
N$82
  Bottom 0.152: U$3.3 J7.1
S_16  (via drill 0.2)
  Top 0.152: v24.86,44.47 18.41,44.47 17.57,43.63 C.3
  Bottom 0.152: R56.1 31.2,50.8 v24.86,44.47
T_CSB  (via drill 0.2)
  Top 0.152: R13.2 8.47,29.25 v8.51,29.21 9.87,29.21 10.97,30.32 11.98,30.32 14.06,28.23 T.61
  Bottom 0.152: v8.51,29.21 8.51,28.63 U$5.1 10.36,27.74 J6.1
T_ISOMD
  Top 0.152: J4.2 16.03,37.31 16.03,35.4 16.35,35.08 16.35,32.22 16.25,32.12 16.03,31.9 15.36,31.23 T.55
T_SCK  (via drill 0.2)
  Top 0.152: R14.1 1.65,30.44 v1.65,29.08 8.1,29.08 8.35,28.83 11.05,28.83 J6.2 12.91,27.73 T.62
  Bottom 0.152: U$5.3 1.65,28.63 v1.65,29.08
T_SDI
  Top 0.152: J6.4 12.57,33.15 12.57,32.77 13.11,32.23 T.53
T_SDO
  Top 0.152: J6.3 11.45,31.73 T.54
T_VREG  (via drill 0.2)
  Top 0.152: T.48 16.51,36.24 J4.3 | v13.97,24.13 12.7,24.13 J1.1
  Bottom 0.152: J4.3 17.78,38.1 17.78,35.98 C4.1 18.12,33.78 16.02,33.78 15.52,33.28 15.52,32.23 15.92,31.83 15.92,31.56 15.92,26.67 16.51,26.67 | 16.51,26.67 16.51,25.4 15.24,24.13 v13.97,24.13 | 16.51,26.67 19.05,26.67 23.5,22.23 U$1.E1
TDRIVE  (via drill 0.2)
  Top 0.152: T.49 15.59,34.23 15.95,33.87 v15.95,32.77
  Bottom 0.152: U$1.B1 23.74,20.71 23.74,22.32 19.15,26.91 17.54,26.91 16.16,28.28 16.16,31.93 15.95,32.15 v15.95,32.77
TEMP16  (via drill 0.2)
  Top 0.152: v74.93,27.94 R47.1 71.97,26.25 68.61,22.89 62.33,22.89 42.56,3.12 R32.2 R51.2
  Bottom 0.152: U$6.2 74.94,40.55 v74.94,27.95 v74.93,27.94
V+  (via drill 0.2)
  Top 0.152: v16.51,22.86 16.57,22.92 | 16.57,22.92 T.1 16.75,24.96 16.75,35.02 16.27,35.5 16.27,38.05 15.4,38.91 15.4,39.83 16.57,40.99 C.1 | C18.1 16.03,22.92 16.57,22.92
  Bottom 0.152: U$2.2 17.38,20.12 16.5,21 16.51,21.02 v16.51,22.86